# Altium project HapticGloveRev2.PrjPcb
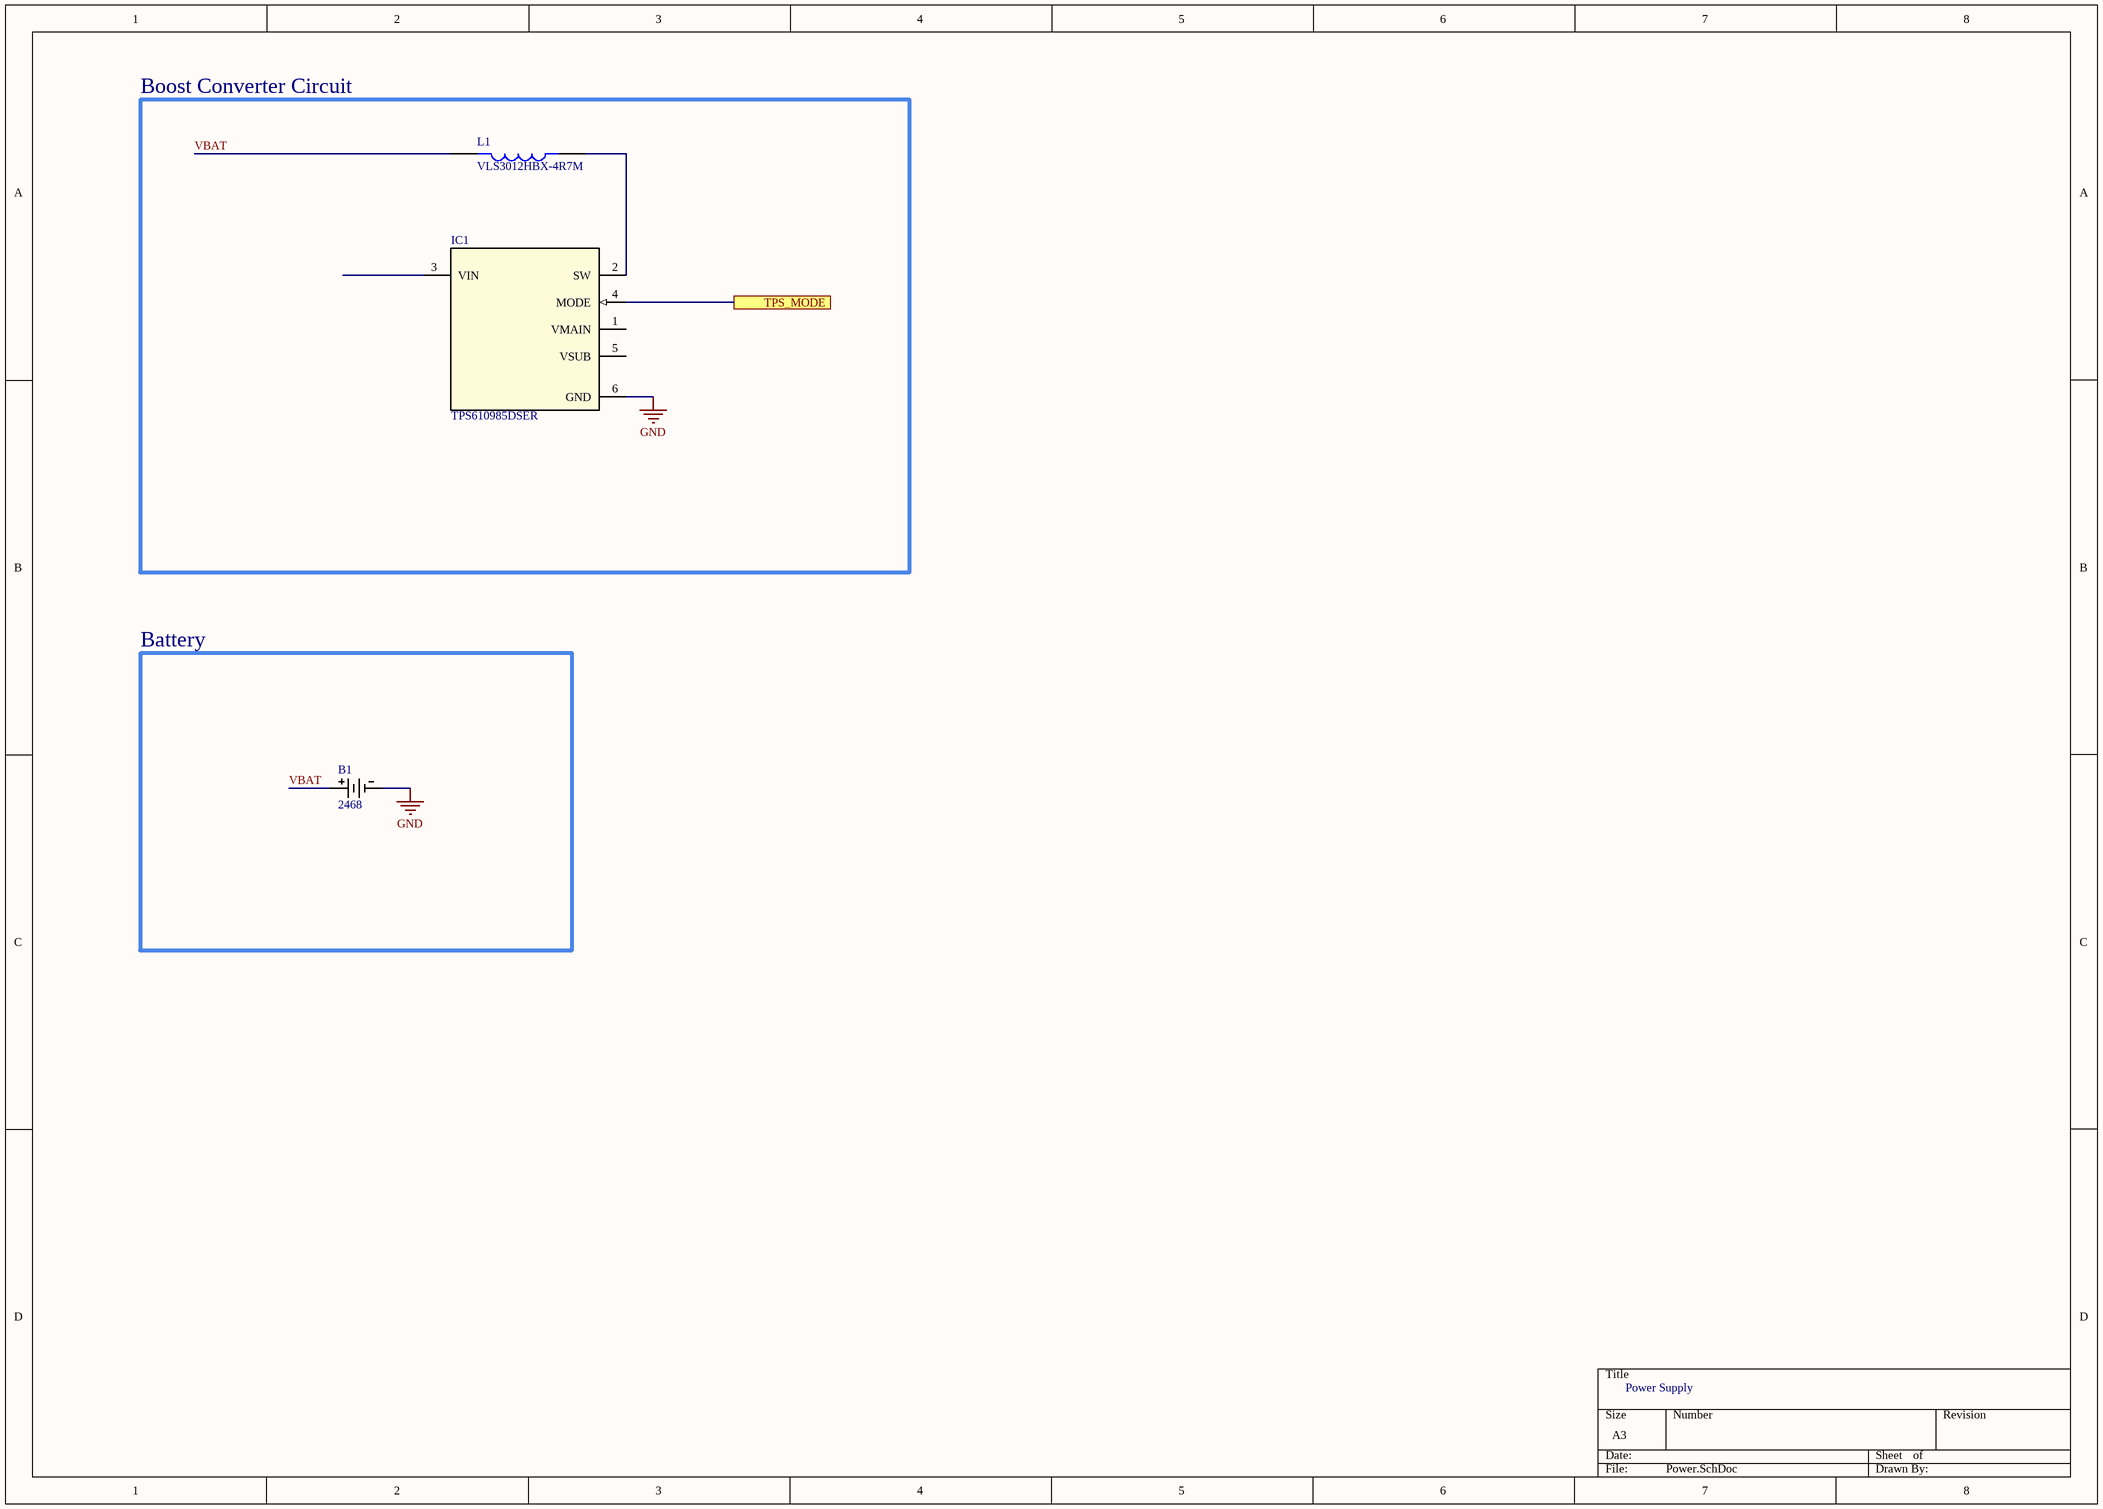
[diagram p0: Power.SchDoc]
1 sheet, 3 parts. Net scope: flat (ports and power ports of the same name join across sheets).

## Sheet Power.SchDoc
size A3; SheetNumber: 1; SheetTotal: 1

### Parts
B1  2468  [2468_KEY]
IC1  TPS610985DSER  [DSE0006A]
L1  VLS3012HBX-4R7M  [IND_VLS3012HBX-4R7M]

### Blocks framed on the sheet
Boost Converter Circuit: IC1 L1
Battery: B1

### Ports
TPS_MODE

### Nets
GND: B1.2 IC1.6(GND)
VBAT: B1.1 L1.2
NetIC1_2: IC1.2(SW) L1.1
NetIC1_4: IC1.4(MODE) ; port TPS_MODE

Not connected (* = marked no-connect by the designer): IC1 1(VMAIN) 3(VIN) 5(VSUB)

### Notes on the sheet
- Power Supply

### Library data of the parts
B1 = 2468: No Description Available; Mfr_Name: Keystone Electronics
IC1 = TPS610985DSER: No Description Available; Mfr_Name: Texas Instruments; TYPE: TYPE; RefDes: RefDes
L1 = VLS3012HBX-4R7M: 4.7 µH Shielded Drum Core, Wirewound Inductor 2.23 A 201mOhm Max Nonstandard -; MF: TDK; SnapEDA_Link: https://www.snapeda.com/parts/VLS3012HBX-4R7M/TDK/view-part/?ref=snap; Package: NON STANDARD-2 TDK; Value: *; MP: VLS3012HBX-4R7M; Check_prices: https://www.snapeda.com/parts/VLS3012HBX-4R7M/TDK/view-part/?ref=eda